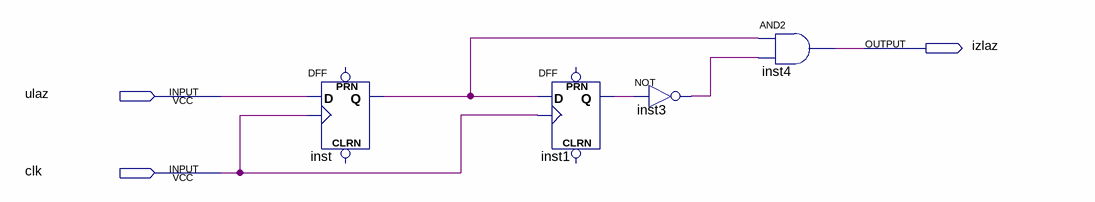
[diagram p0: schematic sheet]
// Quartus schematic risingEdge.bdf as structural Verilog: 4 symbols, 3 pins
module risingEdge (
  input  ulaz,
  input  clk,
  output izlaz
);

  wire inst1_q, inst3_out, inst_q;

  DFF inst (.CLK(clk), .D(ulaz), .Q(inst_q));  // open: CLRN, PRN
  DFF inst1 (.CLK(clk), .D(inst_q), .Q(inst1_q));  // open: CLRN, PRN
  not inst3 (inst3_out, inst1_q);
  and inst4 (izlaz, inst_q, inst3_out);
endmodule
